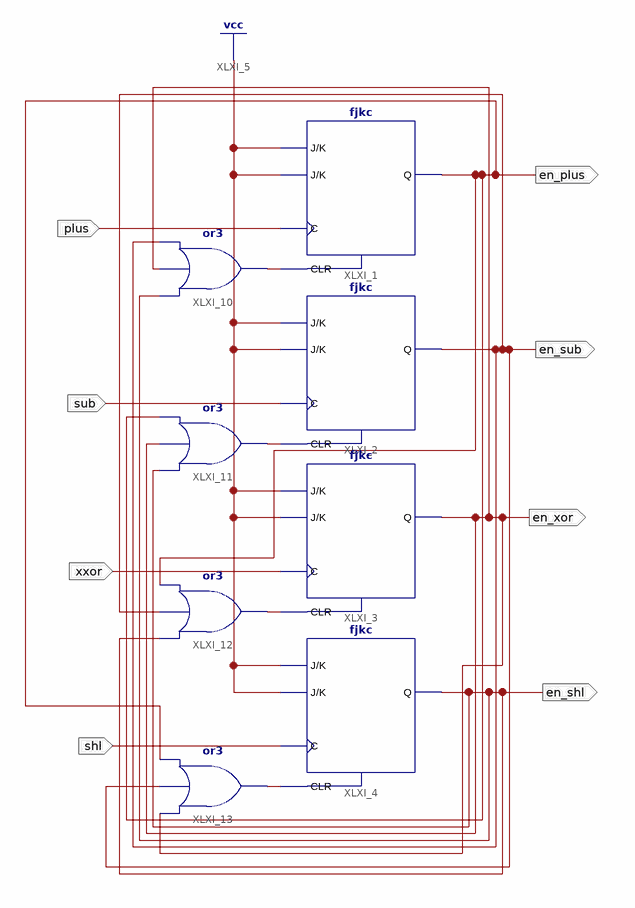
[diagram p0: schematic sheet 1]
// Xilinx ISE schematic selector.sch (spartan6) as structural Verilog: 8 symbols, 8 ports
module selector (
  input  plus,
  input  shl,
  input  sub,
  input  xxor,
  output en_plus,
  output en_sub,
  output en_xor,
  output en_shl
);

  wire XLXN_13, XLXN_15, XLXN_16, XLXN_17;

  fjkc XLXI_1 (.C(plus), .CLR(XLXN_13), .J(1'b1), .K(1'b1), .Q(en_plus));
  fjkc XLXI_2 (.C(sub), .CLR(XLXN_15), .J(1'b1), .K(1'b1), .Q(en_sub));
  fjkc XLXI_3 (.C(xxor), .CLR(XLXN_16), .J(1'b1), .K(1'b1), .Q(en_xor));
  fjkc XLXI_4 (.C(shl), .CLR(XLXN_17), .J(1'b1), .K(1'b1), .Q(en_shl));
  or XLXI_10 (XLXN_13, en_shl, en_xor, en_sub);
  or XLXI_11 (XLXN_15, en_shl, en_xor, en_plus);
  or XLXI_12 (XLXN_16, en_shl, en_sub, en_plus);
  or XLXI_13 (XLXN_17, en_xor, en_sub, en_plus);
endmodule
